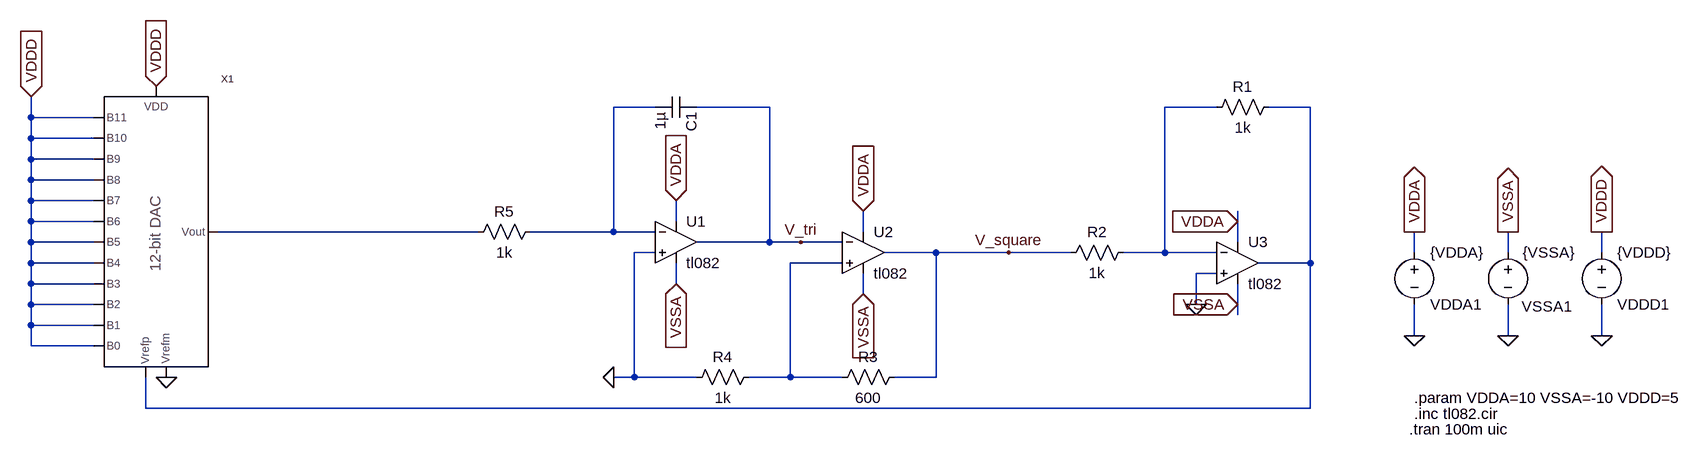
[diagram p0: schematic Simulation_mit_Idealen_12_Bit_DAC.asc]
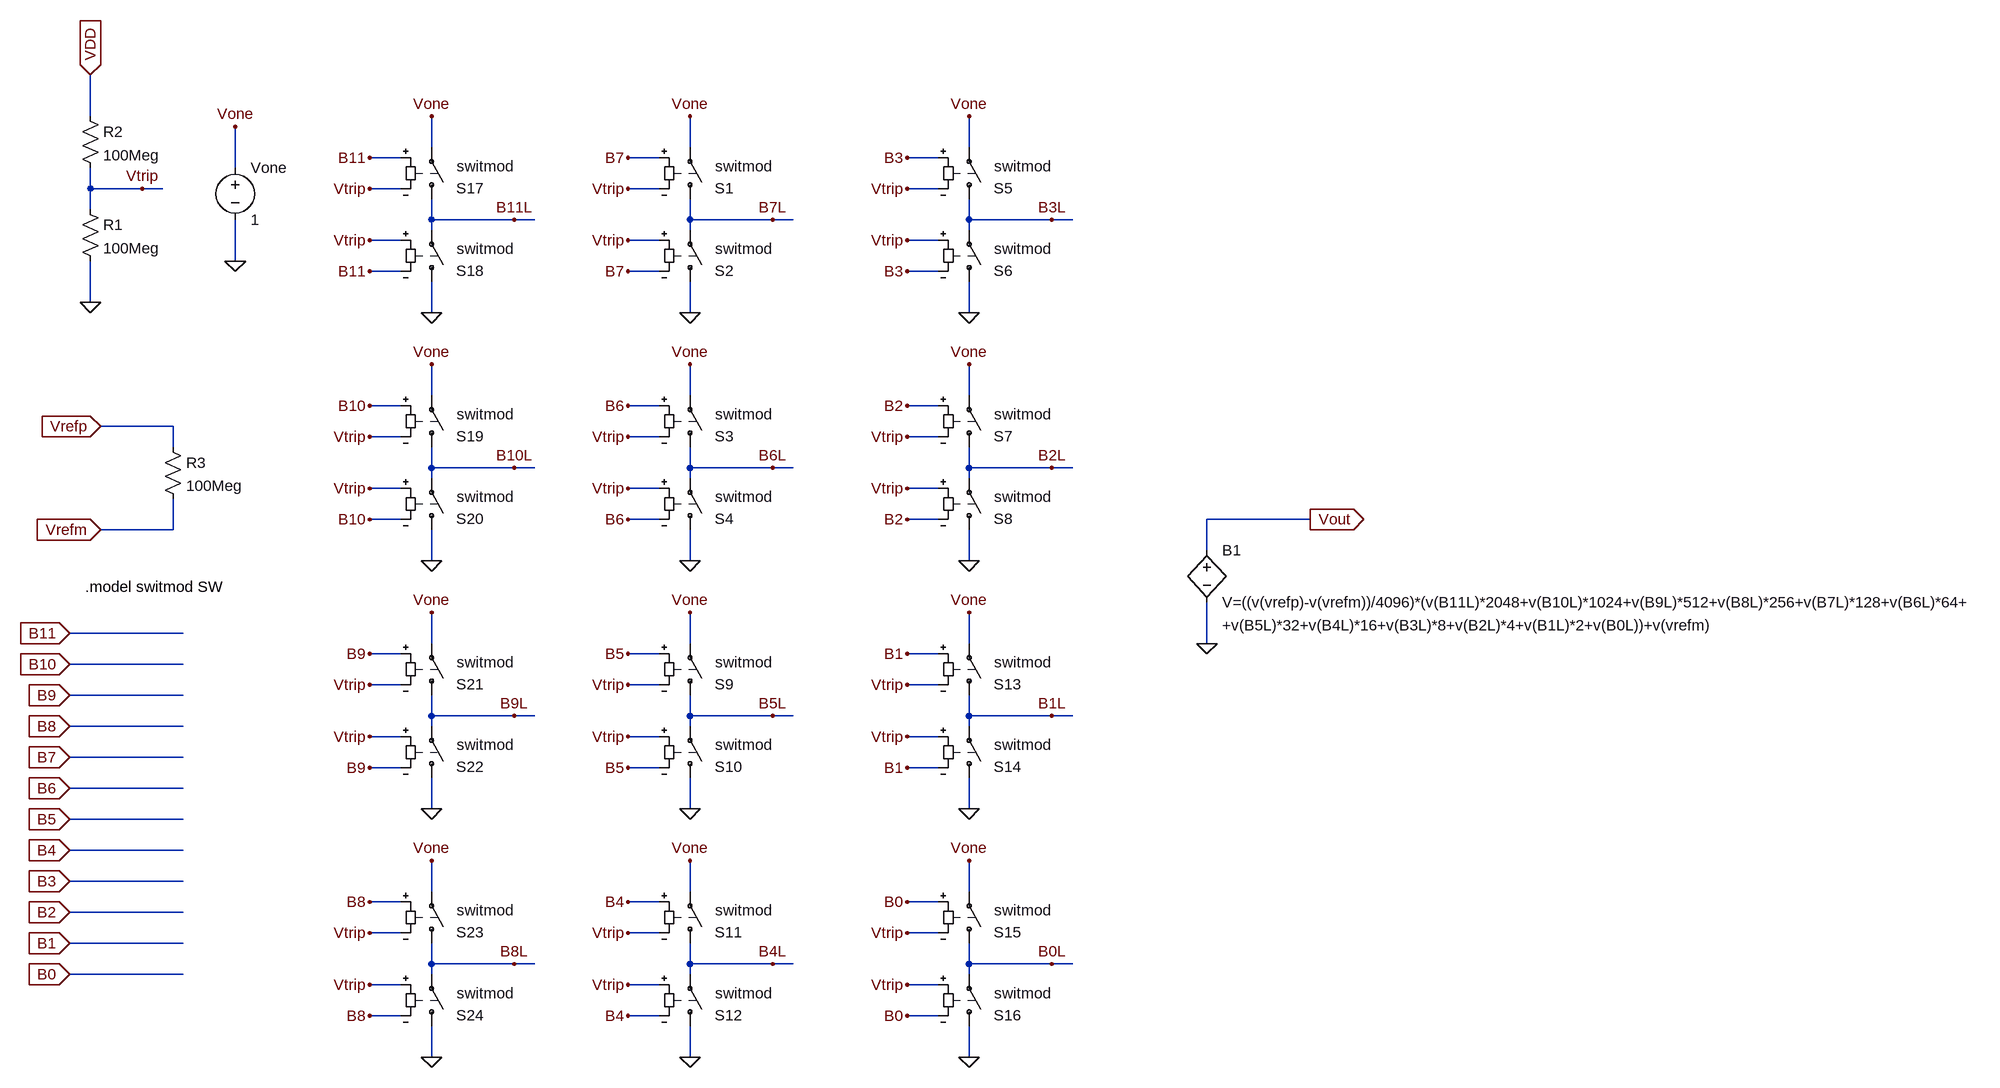
[diagram p1: sub-circuit ideal_12_bit_dac.asc]
Simulation_mit_Idealen_12_Bit_DAC.asc, the LTspice schematic file:
Version 4
SHEET 1 1372 724
WIRE -432 -80 -496 -80
WIRE -256 -80 -368 -80
WIRE 432 -80 352 -80
WIRE 576 -80 512 -80
WIRE -1392 -64 -1392 -96
WIRE -1296 -64 -1392 -64
WIRE -1392 -32 -1392 -64
WIRE -1296 -32 -1392 -32
WIRE -1392 0 -1392 -32
WIRE -1296 0 -1392 0
WIRE -1392 32 -1392 0
WIRE -1296 32 -1392 32
WIRE -1392 64 -1392 32
WIRE -1296 64 -1392 64
WIRE -1392 96 -1392 64
WIRE -1296 96 -1392 96
WIRE -400 96 -400 64
WIRE 464 96 464 80
WIRE -704 112 -1104 112
WIRE -496 112 -496 -80
WIRE -496 112 -624 112
WIRE -432 112 -496 112
WIRE -112 112 -112 80
WIRE -1392 128 -1392 96
WIRE -1296 128 -1392 128
WIRE -256 128 -256 -80
WIRE -256 128 -368 128
WIRE -208 128 -256 128
WIRE -144 128 -208 128
WIRE 464 128 464 96
WIRE -432 144 -464 144
WIRE 0 144 -80 144
WIRE 112 144 0 144
WIRE 208 144 112 144
WIRE 352 144 352 -80
WIRE 352 144 288 144
WIRE 432 144 352 144
WIRE 736 144 736 112
WIRE 880 144 880 112
WIRE 1024 144 1024 112
WIRE -1392 160 -1392 128
WIRE -1296 160 -1392 160
WIRE -144 160 -224 160
WIRE 576 160 576 -80
WIRE 576 160 496 160
WIRE 432 176 400 176
WIRE -1392 192 -1392 160
WIRE -1296 192 -1392 192
WIRE -400 192 -400 160
WIRE -112 208 -112 176
WIRE -1392 224 -1392 192
WIRE -1296 224 -1392 224
WIRE 400 224 400 176
WIRE 464 224 464 192
WIRE 464 240 464 224
WIRE -1392 256 -1392 224
WIRE -1296 256 -1392 256
WIRE 736 272 736 224
WIRE 880 272 880 224
WIRE 1024 272 1024 224
WIRE -1392 288 -1392 256
WIRE -1296 288 -1392 288
WIRE -464 336 -464 144
WIRE -464 336 -496 336
WIRE -368 336 -464 336
WIRE -224 336 -224 160
WIRE -224 336 -288 336
WIRE -144 336 -224 336
WIRE 0 336 0 144
WIRE 0 336 -64 336
WIRE -1216 384 -1216 336
WIRE 576 384 576 160
WIRE 576 384 -1216 384
FLAG 400 224 0
FLAG 112 144 V_square
FLAG -208 128 V_tri
FLAG -400 192 VSSA
IOPIN -400 192 In
FLAG -112 208 VSSA
IOPIN -112 208 In
FLAG 464 224 VSSA
IOPIN 464 224 In
FLAG -400 64 VDDA
IOPIN -400 64 In
FLAG -112 80 VDDA
IOPIN -112 80 In
FLAG 464 96 VDDA
IOPIN 464 96 In
FLAG 736 272 0
FLAG 880 272 0
FLAG 736 112 VDDA
IOPIN 736 112 Out
FLAG 880 112 VSSA
IOPIN 880 112 Out
FLAG 1024 272 0
FLAG 1024 112 VDDD
IOPIN 1024 112 Out
FLAG -496 336 0
FLAG -1200 -112 VDDD
IOPIN -1200 -112 In
FLAG -1184 336 0
FLAG -1392 -96 VDDD
IOPIN -1392 -96 In
SYMBOL Opamps\\opamp2 -400 64 R0
SYMATTR InstName U1
SYMATTR Value tl082
SYMBOL Opamps\\opamp2 -112 80 R0
SYMATTR InstName U2
SYMATTR Value tl082
SYMBOL Opamps\\opamp2 464 96 R0
SYMATTR InstName U3
SYMATTR Value tl082
SYMBOL res 528 -96 R90
WINDOW 0 0 56 VBottom 2
WINDOW 3 32 56 VTop 2
SYMATTR InstName R1
SYMATTR Value 1k
SYMBOL res 304 128 R90
WINDOW 0 0 56 VBottom 2
WINDOW 3 32 56 VTop 2
SYMATTR InstName R2
SYMATTR Value 1k
SYMBOL res -48 320 R90
WINDOW 0 0 56 VBottom 2
WINDOW 3 32 56 VTop 2
SYMATTR InstName R3
SYMATTR Value 600
SYMBOL res -384 352 R270
WINDOW 0 32 56 VTop 2
WINDOW 3 0 56 VBottom 2
SYMATTR InstName R4
SYMATTR Value 1k
SYMBOL cap -368 -96 R90
SYMATTR Value 1µ
SYMATTR InstName C1
SYMBOL voltage 736 128 R0
WINDOW 0 24 96 Left 2
WINDOW 3 24 16 Left 2
WINDOW 123 0 0 Left 0
WINDOW 39 0 0 Left 0
SYMATTR InstName VDDA1
SYMATTR Value {VDDA}
SYMBOL voltage 880 128 R0
WINDOW 123 0 0 Left 0
WINDOW 39 0 0 Left 0
WINDOW 0 21 99 Left 2
WINDOW 3 23 16 Left 2
SYMATTR InstName VSSA1
SYMATTR Value {VSSA}
SYMBOL voltage 1024 128 R0
WINDOW 0 24 96 Left 2
WINDOW 3 24 16 Left 2
WINDOW 123 0 0 Left 0
WINDOW 39 0 0 Left 0
SYMATTR InstName VDDD1
SYMATTR Value {VDDD}
SYMBOL res -608 96 R90
WINDOW 0 0 56 VBottom 2
WINDOW 3 32 56 VTop 2
SYMATTR InstName R5
SYMATTR Value 1k
SYMBOL Ideal_12_bit_DAC -1280 320 R0
SYMATTR InstName X1
TEXT 736 392 Left 2 !.inc tl082.cir
TEXT 736 368 Left 2 !.param VDDA=10 VSSA=-10 VDDD=5
TEXT 728 416 Left 2 !.tran 100m uic

ideal_12_bit_dac.asc, the sub-circuit schematic file:
Version 4
SHEET 1 3600 1316
WIRE 528 -192 528 -256
WIRE 1056 -144 1056 -192
WIRE 1456 -144 1456 -192
WIRE 1888 -144 1888 -192
WIRE 1008 -128 960 -128
WIRE 1408 -128 1360 -128
WIRE 1840 -128 1792 -128
WIRE 752 -112 752 -176
WIRE 528 -80 528 -112
WIRE 608 -80 528 -80
WIRE 640 -80 608 -80
WIRE 1008 -80 960 -80
WIRE 1408 -80 1360 -80
WIRE 1840 -80 1792 -80
WIRE 528 -48 528 -80
WIRE 1056 -32 1056 -64
WIRE 1184 -32 1056 -32
WIRE 1216 -32 1184 -32
WIRE 1456 -32 1456 -64
WIRE 1584 -32 1456 -32
WIRE 1616 -32 1584 -32
WIRE 1888 -32 1888 -64
WIRE 2016 -32 1888 -32
WIRE 2048 -32 2016 -32
WIRE 1056 -16 1056 -32
WIRE 1456 -16 1456 -32
WIRE 1888 -16 1888 -32
WIRE 1008 0 960 0
WIRE 1408 0 1360 0
WIRE 1840 0 1792 0
WIRE 752 32 752 -32
WIRE 1008 48 960 48
WIRE 1408 48 1360 48
WIRE 1840 48 1792 48
WIRE 528 96 528 32
WIRE 1056 112 1056 64
WIRE 1456 112 1456 64
WIRE 1888 112 1888 64
WIRE 1056 240 1056 192
WIRE 1456 240 1456 192
WIRE 1888 240 1888 192
WIRE 1008 256 960 256
WIRE 1408 256 1360 256
WIRE 1840 256 1792 256
WIRE 656 288 544 288
WIRE 1008 304 960 304
WIRE 1408 304 1360 304
WIRE 1840 304 1792 304
WIRE 656 320 656 288
WIRE 1056 352 1056 320
WIRE 1184 352 1056 352
WIRE 1216 352 1184 352
WIRE 1456 352 1456 320
WIRE 1584 352 1456 352
WIRE 1616 352 1584 352
WIRE 1888 352 1888 320
WIRE 2016 352 1888 352
WIRE 2048 352 2016 352
WIRE 1056 368 1056 352
WIRE 1456 368 1456 352
WIRE 1888 368 1888 352
WIRE 1008 384 960 384
WIRE 1408 384 1360 384
WIRE 1840 384 1792 384
WIRE 1008 432 960 432
WIRE 1408 432 1360 432
WIRE 1840 432 1792 432
WIRE 2416 432 2256 432
WIRE 656 448 656 400
WIRE 656 448 544 448
WIRE 2256 480 2256 432
WIRE 1056 496 1056 448
WIRE 1456 496 1456 448
WIRE 1888 496 1888 448
WIRE 672 608 496 608
WIRE 1056 624 1056 576
WIRE 1456 624 1456 576
WIRE 1888 624 1888 576
WIRE 2256 624 2256 560
WIRE 1008 640 960 640
WIRE 1408 640 1360 640
WIRE 1840 640 1792 640
WIRE 672 656 496 656
WIRE 1008 688 960 688
WIRE 1408 688 1360 688
WIRE 1840 688 1792 688
WIRE 672 704 496 704
WIRE 1056 736 1056 704
WIRE 1184 736 1056 736
WIRE 1216 736 1184 736
WIRE 1456 736 1456 704
WIRE 1584 736 1456 736
WIRE 1616 736 1584 736
WIRE 1888 736 1888 704
WIRE 2016 736 1888 736
WIRE 2048 736 2016 736
WIRE 672 752 496 752
WIRE 1056 752 1056 736
WIRE 1456 752 1456 736
WIRE 1888 752 1888 736
WIRE 1008 768 960 768
WIRE 1408 768 1360 768
WIRE 1840 768 1792 768
WIRE 672 800 496 800
WIRE 1008 816 960 816
WIRE 1408 816 1360 816
WIRE 1840 816 1792 816
WIRE 672 848 496 848
WIRE 1056 880 1056 832
WIRE 1456 880 1456 832
WIRE 1888 880 1888 832
WIRE 672 896 496 896
WIRE 672 944 496 944
WIRE 672 992 496 992
WIRE 1056 1008 1056 960
WIRE 1456 1008 1456 960
WIRE 1888 1008 1888 960
WIRE 1008 1024 960 1024
WIRE 1408 1024 1360 1024
WIRE 1840 1024 1792 1024
WIRE 672 1040 496 1040
WIRE 1008 1072 960 1072
WIRE 1408 1072 1360 1072
WIRE 1840 1072 1792 1072
WIRE 672 1088 496 1088
WIRE 1056 1120 1056 1088
WIRE 1184 1120 1056 1120
WIRE 1216 1120 1184 1120
WIRE 1456 1120 1456 1088
WIRE 1584 1120 1456 1120
WIRE 1616 1120 1584 1120
WIRE 1888 1120 1888 1088
WIRE 2016 1120 1888 1120
WIRE 2048 1120 2016 1120
WIRE 672 1136 496 1136
WIRE 1056 1136 1056 1120
WIRE 1456 1136 1456 1120
WIRE 1888 1136 1888 1120
WIRE 1008 1152 960 1152
WIRE 1408 1152 1360 1152
WIRE 1840 1152 1792 1152
WIRE 1008 1200 960 1200
WIRE 1408 1200 1360 1200
WIRE 1840 1200 1792 1200
WIRE 1056 1264 1056 1216
WIRE 1456 1264 1456 1216
WIRE 1888 1264 1888 1216
FLAG 1360 -128 B7
FLAG 1360 -80 Vtrip
FLAG 608 -80 Vtrip
FLAG 528 -256 VDD
IOPIN 528 -256 In
FLAG 1360 0 Vtrip
FLAG 1360 48 B7
FLAG 1584 -32 B7L
FLAG 1456 112 0
FLAG 1360 256 B6
FLAG 1360 304 Vtrip
FLAG 1360 384 Vtrip
FLAG 1360 432 B6
FLAG 1584 352 B6L
FLAG 1456 496 0
FLAG 1792 -128 B3
FLAG 1792 -80 Vtrip
FLAG 1792 0 Vtrip
FLAG 1792 48 B3
FLAG 2016 -32 B3L
FLAG 1888 112 0
FLAG 1792 256 B2
FLAG 1792 304 Vtrip
FLAG 1792 384 Vtrip
FLAG 1792 432 B2
FLAG 2016 352 B2L
FLAG 1888 496 0
FLAG 1360 640 B5
FLAG 1360 688 Vtrip
FLAG 1360 768 Vtrip
FLAG 1360 816 B5
FLAG 1584 736 B5L
FLAG 1456 880 0
FLAG 1360 1024 B4
FLAG 1360 1072 Vtrip
FLAG 1360 1152 Vtrip
FLAG 1360 1200 B4
FLAG 1584 1120 B4L
FLAG 1456 1264 0
FLAG 1792 640 B1
FLAG 1792 688 Vtrip
FLAG 1792 768 Vtrip
FLAG 1792 816 B1
FLAG 2016 736 B1L
FLAG 1888 880 0
FLAG 1792 1024 B0
FLAG 1792 1072 Vtrip
FLAG 1792 1152 Vtrip
FLAG 1792 1200 B0
FLAG 2016 1120 B0L
FLAG 1888 1264 0
FLAG 2256 624 0
FLAG 2416 432 Vout
IOPIN 2416 432 Out
FLAG 544 288 Vrefp
IOPIN 544 288 In
FLAG 544 448 Vrefm
IOPIN 544 448 In
FLAG 496 800 B7
IOPIN 496 800 In
FLAG 496 848 B6
IOPIN 496 848 In
FLAG 496 896 B5
IOPIN 496 896 In
FLAG 496 944 B4
IOPIN 496 944 In
FLAG 496 992 B3
IOPIN 496 992 In
FLAG 496 1040 B2
IOPIN 496 1040 In
FLAG 496 1088 B1
IOPIN 496 1088 In
FLAG 496 1136 B0
IOPIN 496 1136 In
FLAG 528 96 0
FLAG 496 608 B11
IOPIN 496 608 In
FLAG 496 656 B10
IOPIN 496 656 In
FLAG 496 704 B9
IOPIN 496 704 In
FLAG 496 752 B8
IOPIN 496 752 In
FLAG 960 -128 B11
FLAG 960 -80 Vtrip
FLAG 960 0 Vtrip
FLAG 960 48 B11
FLAG 1184 -32 B11L
FLAG 1056 112 0
FLAG 960 256 B10
FLAG 960 304 Vtrip
FLAG 960 384 Vtrip
FLAG 960 432 B10
FLAG 1184 352 B10L
FLAG 1056 496 0
FLAG 960 640 B9
FLAG 960 688 Vtrip
FLAG 960 768 Vtrip
FLAG 960 816 B9
FLAG 1184 736 B9L
FLAG 1056 880 0
FLAG 960 1024 B8
FLAG 960 1072 Vtrip
FLAG 960 1152 Vtrip
FLAG 960 1200 B8
FLAG 1184 1120 B8L
FLAG 1056 1264 0
FLAG 1056 -192 Vone
FLAG 1456 -192 Vone
FLAG 1888 -192 Vone
FLAG 1888 192 Vone
FLAG 1456 192 Vone
FLAG 1056 192 Vone
FLAG 1056 576 Vone
FLAG 1456 576 Vone
FLAG 1888 576 Vone
FLAG 1888 960 Vone
FLAG 1456 960 Vone
FLAG 1056 960 Vone
FLAG 752 -176 Vone
FLAG 752 32 0
SYMBOL sw 1456 -48 M180
WINDOW 3 24 -12 Left 0
WINDOW 38 39 67 Left 2
WINDOW 0 38 33 Left 2
SYMATTR Value ""
SYMATTR SpiceModel switmod
SYMATTR InstName S1
SYMBOL res 512 -64 R0
SYMATTR InstName R1
SYMATTR Value 100Meg
SYMBOL res 512 -208 R0
SYMATTR InstName R2
SYMATTR Value 100Meg
SYMBOL sw 1456 80 M180
WINDOW 3 24 -12 Left 0
WINDOW 38 39 67 Left 2
WINDOW 0 38 33 Left 2
SYMATTR Value ""
SYMATTR SpiceModel switmod
SYMATTR InstName S2
SYMBOL sw 1456 336 M180
WINDOW 3 24 -12 Left 0
WINDOW 38 39 67 Left 2
WINDOW 0 38 33 Left 2
SYMATTR Value ""
SYMATTR SpiceModel switmod
SYMATTR InstName S3
SYMBOL sw 1456 464 M180
WINDOW 3 24 -12 Left 0
WINDOW 38 39 67 Left 2
WINDOW 0 38 33 Left 2
SYMATTR Value ""
SYMATTR SpiceModel switmod
SYMATTR InstName S4
SYMBOL sw 1888 -48 M180
WINDOW 3 24 -12 Left 0
WINDOW 38 39 67 Left 2
WINDOW 0 38 33 Left 2
SYMATTR Value ""
SYMATTR SpiceModel switmod
SYMATTR InstName S5
SYMBOL sw 1888 80 M180
WINDOW 3 24 -12 Left 0
WINDOW 38 39 67 Left 2
WINDOW 0 38 33 Left 2
SYMATTR Value ""
SYMATTR SpiceModel switmod
SYMATTR InstName S6
SYMBOL sw 1888 336 M180
WINDOW 3 24 -12 Left 0
WINDOW 38 39 67 Left 2
WINDOW 0 38 33 Left 2
SYMATTR Value ""
SYMATTR SpiceModel switmod
SYMATTR InstName S7
SYMBOL sw 1888 464 M180
WINDOW 3 24 -12 Left 0
WINDOW 38 39 67 Left 2
WINDOW 0 38 33 Left 2
SYMATTR Value ""
SYMATTR SpiceModel switmod
SYMATTR InstName S8
SYMBOL sw 1456 720 M180
WINDOW 3 24 -12 Left 0
WINDOW 38 39 67 Left 2
WINDOW 0 38 33 Left 2
SYMATTR Value ""
SYMATTR SpiceModel switmod
SYMATTR InstName S9
SYMBOL sw 1456 848 M180
WINDOW 3 24 -12 Left 0
WINDOW 38 39 67 Left 2
WINDOW 0 38 33 Left 2
SYMATTR Value ""
SYMATTR SpiceModel switmod
SYMATTR InstName S10
SYMBOL sw 1456 1104 M180
WINDOW 3 24 -12 Left 0
WINDOW 38 39 67 Left 2
WINDOW 0 38 33 Left 2
SYMATTR Value ""
SYMATTR SpiceModel switmod
SYMATTR InstName S11
SYMBOL sw 1456 1232 M180
WINDOW 3 24 -12 Left 0
WINDOW 38 39 67 Left 2
WINDOW 0 38 33 Left 2
SYMATTR Value ""
SYMATTR SpiceModel switmod
SYMATTR InstName S12
SYMBOL sw 1888 720 M180
WINDOW 3 24 -12 Left 0
WINDOW 38 39 67 Left 2
WINDOW 0 38 33 Left 2
SYMATTR Value ""
SYMATTR SpiceModel switmod
SYMATTR InstName S13
SYMBOL sw 1888 848 M180
WINDOW 3 24 -12 Left 0
WINDOW 38 39 67 Left 2
WINDOW 0 38 33 Left 2
SYMATTR Value ""
SYMATTR SpiceModel switmod
SYMATTR InstName S14
SYMBOL sw 1888 1104 M180
WINDOW 3 24 -12 Left 0
WINDOW 38 39 67 Left 2
WINDOW 0 38 33 Left 2
SYMATTR Value ""
SYMATTR SpiceModel switmod
SYMATTR InstName S15
SYMBOL sw 1888 1232 M180
WINDOW 3 24 -12 Left 0
WINDOW 38 39 67 Left 2
WINDOW 0 38 33 Left 2
SYMATTR Value ""
SYMATTR SpiceModel switmod
SYMATTR InstName S16
SYMBOL bv 2256 464 R0
WINDOW 123 24 132 Left 2
SYMATTR Value2 +v(B5L)*32+v(B4L)*16+v(B3L)*8+v(B2L)*4+v(B1L)*2+v(B0L))+v(vrefm)
SYMATTR InstName B1
SYMATTR Value V=((v(vrefp)-v(vrefm))/4096)*(v(B11L)*2048+v(B10L)*1024+v(B9L)*512+v(B8L)*256+v(B7L)*128+v(B6L)*64+
SYMBOL res 640 304 R0
SYMATTR InstName R3
SYMATTR Value 100Meg
SYMBOL sw 1056 -48 M180
WINDOW 3 24 -12 Left 0
WINDOW 38 39 67 Left 2
WINDOW 0 38 33 Left 2
SYMATTR Value ""
SYMATTR SpiceModel switmod
SYMATTR InstName S17
SYMBOL sw 1056 80 M180
WINDOW 3 24 -12 Left 0
WINDOW 38 39 67 Left 2
WINDOW 0 38 33 Left 2
SYMATTR Value ""
SYMATTR SpiceModel switmod
SYMATTR InstName S18
SYMBOL sw 1056 336 M180
WINDOW 3 24 -12 Left 0
WINDOW 38 39 67 Left 2
WINDOW 0 38 33 Left 2
SYMATTR Value ""
SYMATTR SpiceModel switmod
SYMATTR InstName S19
SYMBOL sw 1056 464 M180
WINDOW 3 24 -12 Left 0
WINDOW 38 39 67 Left 2
WINDOW 0 38 33 Left 2
SYMATTR Value ""
SYMATTR SpiceModel switmod
SYMATTR InstName S20
SYMBOL sw 1056 720 M180
WINDOW 3 24 -12 Left 0
WINDOW 38 39 67 Left 2
WINDOW 0 38 33 Left 2
SYMATTR Value ""
SYMATTR SpiceModel switmod
SYMATTR InstName S21
SYMBOL sw 1056 848 M180
WINDOW 3 24 -12 Left 0
WINDOW 38 39 67 Left 2
WINDOW 0 38 33 Left 2
SYMATTR Value ""
SYMATTR SpiceModel switmod
SYMATTR InstName S22
SYMBOL sw 1056 1104 M180
WINDOW 3 24 -12 Left 0
WINDOW 38 39 67 Left 2
WINDOW 0 38 33 Left 2
SYMATTR Value ""
SYMATTR SpiceModel switmod
SYMATTR InstName S23
SYMBOL sw 1056 1232 M180
WINDOW 3 24 -12 Left 0
WINDOW 38 39 67 Left 2
WINDOW 0 38 33 Left 2
SYMATTR Value ""
SYMATTR SpiceModel switmod
SYMATTR InstName S24
SYMBOL voltage 752 -128 R0
WINDOW 123 0 0 Left 0
WINDOW 39 0 0 Left 0
SYMATTR InstName Vone
SYMATTR Value 1
TEXT 520 536 Left 2 !.model switmod SW

The netlist it stands for:
* Simulation_mit_Idealen_12_Bit_DAC.asc
XU1 0 N001 VDDA VSSA V_tri tl082  ; pins In+ In- V+ V- OUT
XU2 N005 V_tri VDDA VSSA V_square tl082  ; pins In+ In- V+ V- OUT
XU3 0 N002 VDDA VSSA N003 tl082  ; pins In+ In- V+ V- OUT
R1 N003 N002 1k
R2 N002 V_square 1k
R3 V_square N005 600
R4 0 N005 1k
C1 V_tri N001 1µ
VDDA1 VDDA 0 {VDDA}
VSSA1 VSSA 0 {VSSA}
VDDD1 VDDD 0 {VDDD}
R5 N001 N004 1k
XX1 VDDD VDDD VDDD VDDD VDDD VDDD VDDD VDDD VDDD VDDD VDDD VDDD N004 N003 0 VDDD ideal_12_bit_dac

* block symbol definitions
.subckt ideal_12_bit_dac B11 B10 B9 B8 B7 B6 B5 B4 B3 B2 B1 B0 Vout Vrefp Vrefm VDD
S1 B7L Vone B7 Vtrip switmod
R1 Vtrip 0 100Meg
R2 VDD Vtrip 100Meg
S2 0 B7L Vtrip B7 switmod
S3 B6L Vone B6 Vtrip switmod
S4 0 B6L Vtrip B6 switmod
S5 B3L Vone B3 Vtrip switmod
S6 0 B3L Vtrip B3 switmod
S7 B2L Vone B2 Vtrip switmod
S8 0 B2L Vtrip B2 switmod
S9 B5L Vone B5 Vtrip switmod
S10 0 B5L Vtrip B5 switmod
S11 B4L Vone B4 Vtrip switmod
S12 0 B4L Vtrip B4 switmod
S13 B1L Vone B1 Vtrip switmod
S14 0 B1L Vtrip B1 switmod
S15 B0L Vone B0 Vtrip switmod
S16 0 B0L Vtrip B0 switmod
B1 Vout 0 V=((v(vrefp)-v(vrefm))/4096)*(v(B11L)*2048+v(B10L)*1024+v(B9L)*512+v(B8L)*256+v(B7L)*128+v(B6L)*64+ +v(B5L)*32+v(B4L)*16+v(B3L)*8+v(B2L)*4+v(B1L)*2+v(B0L))+v(vrefm)
R3 Vrefp Vrefm 100Meg
S17 B11L Vone B11 Vtrip switmod
S18 0 B11L Vtrip B11 switmod
S19 B10L Vone B10 Vtrip switmod
S20 0 B10L Vtrip B10 switmod
S21 B9L Vone B9 Vtrip switmod
S22 0 B9L Vtrip B9 switmod
S23 B8L Vone B8 Vtrip switmod
S24 0 B8L Vtrip B8 switmod
Vone Vone 0 1
.model switmod SW
.ends ideal_12_bit_dac

.inc tl082.cir
.param VDDA=10 VSSA=-10 VDDD=5
.tran 100m uic
.backanno
.end